# Altium project DOOR_PCB_MAIN.PrjPcb
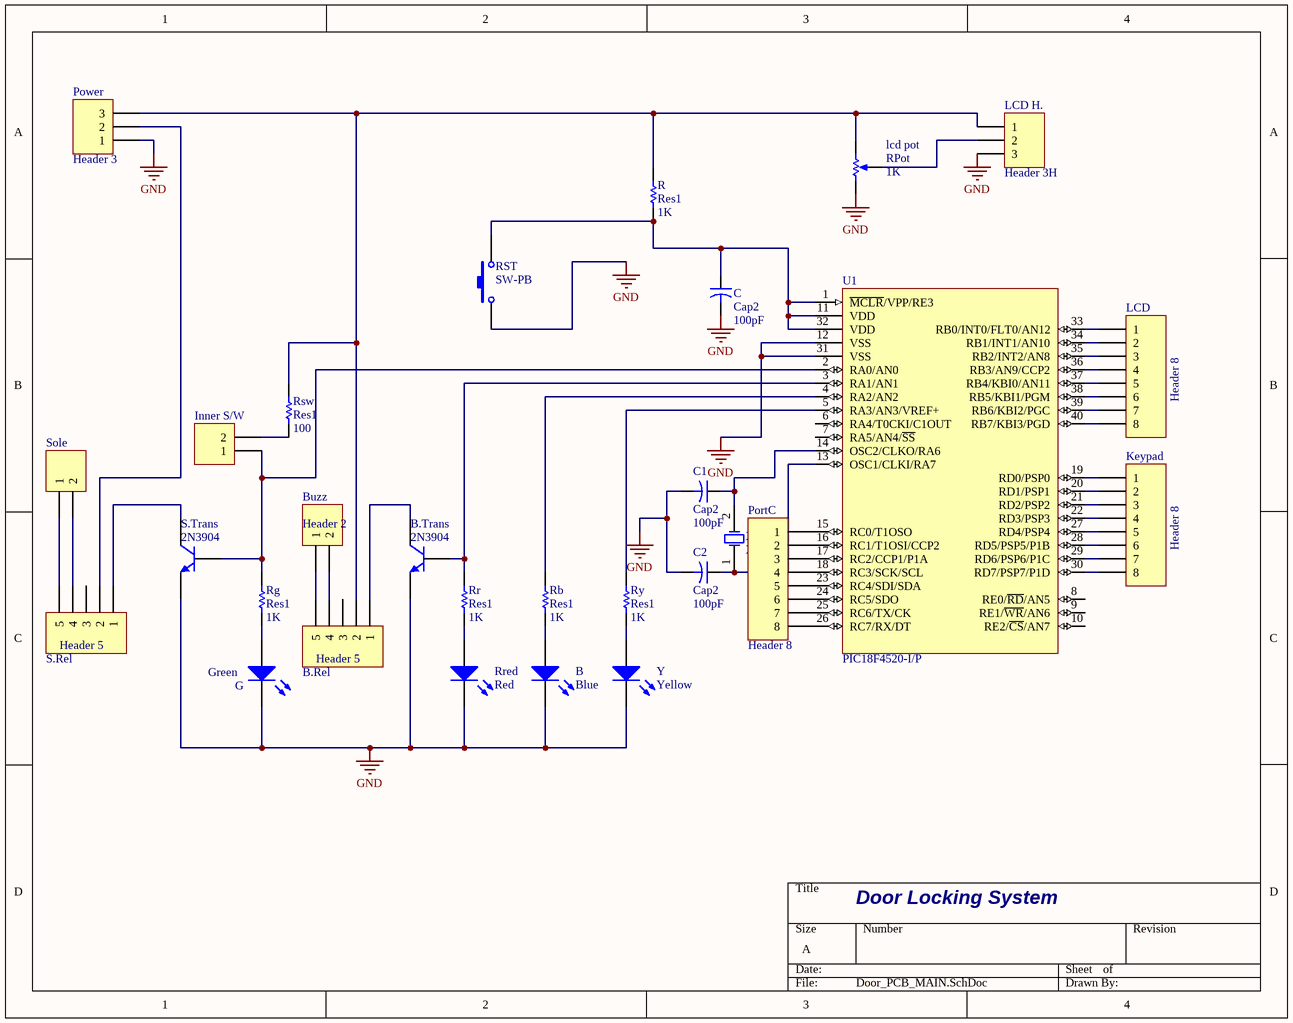
[diagram p0: Door_PCB_MAIN.SchDoc]
1 sheet, 29 parts. Net scope: global (net labels, ports and power ports of the same name join across sheets).
Board file: DOOR_PCB_MAIN.PcbDoc

## Sheet Door_PCB_MAIN.SchDoc
size A

### Parts
B  Blue  [LED-0]
B.Rel  Header 5  [relay]
B.Trans  2N3904  [HDR1X3]
Buzz  Header 2  [HDR1X2]
C  Cap2  value 100pF  [CAPR5-4X5]
C1  Cap2  value 100pF  [CAPR5-4X5]
C2  Cap2  value 100pF  [CAPR5-4X5]
G  Green  [LED-0]
Inner_S/W  Header 2  [HDR1X2]  (value not drawn)
Keypad  Header 8  [HDR1X8]
LCD  Header 8  [HDR1X8]
LCD_H.  Header 3H  [HDR1X3H]
lcd_pot  RPot  value 1K  [VR5]
PortC  Header 8  [HDR1X8]
Power  Header 3  [HDR1X3]
R  Res1  value 1K  [AXIAL-0.3]
Rb  Res1  value 1K  [AXIAL-0.3]
Rg  Res1  value 1K  [AXIAL-0.3]
Rr  Res1  value 1K  [AXIAL-0.3]
Rred  Red  [LED-0]
RST  SW-PB  [SPST-2]
Rsw  Res1  value 100  [AXIAL-0.3]
Ry  Res1  value 1K  [AXIAL-0.3]
S.Rel  Header 5  [relay]
S.Trans  2N3904  [HDR1X3]
Sole  Header 2  [HDR1X2]  (value not drawn)
U1  PIC18F4520-I/P  [PDIP600-P40]
X  XTAL  [R38]
Y  Yellow  [LED-0]

### Nets
GND: B.2(K) B.Trans.1(E) C.2 C1.2 C2.2 G.2(K) LCD_H..3 lcd_pot.1(TOP) Power.1 Rred.2(K) RST.1 S.Trans.1(E) U1.12(VSS) U1.31(VSS) Y.2(K)
NetB.Rel_1: B.Rel.1 B.Trans.3(C)
NetB.Rel_2: B.Rel.2 LCD_H..1 lcd_pot.2(BOT) Power.3 R.2 Rsw.2
NetB.Rel_4: B.Rel.4 Buzz.2
NetB.Rel_5: B.Rel.5 Buzz.1
NetB.Trans_2: B.Trans.2(B) Rr.2 U1.3(RA1/AN1)
NetB_1: B.1(A) Rb.1
NetC1_1: C1.1 U1.14(OSC2/CLKO/RA6) X.2(OSC2)
NetC2_1: C2.1 U1.13(OSC1/CLKI/RA7) X.1(OSC1)
NetC_1: C.1 R.1 RST.2 U1.1(~{MCLR}/VPP/RE3) U1.11(VDD) U1.32(VDD)
NetG_1: G.1(A) Rg.1
NetInner_S/W_1: Inner_S/W.1 Rg.2 S.Trans.2(B) U1.2(RA0/AN0)
NetInner_S/W_2: Inner_S/W.2 Rsw.1
NetKeypad_1: Keypad.1 U1.19(RD0/PSP0)
NetKeypad_2: Keypad.2 U1.20(RD1/PSP1)
NetKeypad_3: Keypad.3 U1.21(RD2/PSP2)
NetKeypad_4: Keypad.4 U1.22(RD3/PSP3)
NetKeypad_5: Keypad.5 U1.27(RD4/PSP4)
NetKeypad_6: Keypad.6 U1.28(RD5/PSP5/P1B)
NetKeypad_7: Keypad.7 U1.29(RD6/PSP6/P1C)
NetKeypad_8: Keypad.8 U1.30(RD7/PSP7/P1D)
NetLCD_1: LCD.1 U1.33(RB0/INT0/FLT0/AN12)
NetLCD_2: LCD.2 U1.34(RB1/INT1/AN10)
NetLCD_3: LCD.3 U1.35(RB2/INT2/AN8)
NetLCD_4: LCD.4 U1.36(RB3/AN9/CCP2)
NetLCD_5: LCD.5 U1.37(RB4/KBI0/AN11)
NetLCD_6: LCD.6 U1.38(RB5/KBI1/PGM)
NetLCD_7: LCD.7 U1.39(RB6/KBI2/PGC)
NetLCD_8: LCD.8 U1.40(RB7/KBI3/PGD)
NetLCD_H._2: LCD_H..2 lcd_pot.3(TAP)
NetPortC_1: PortC.1 U1.15(RC0/T1OSO)
NetPortC_2: PortC.2 U1.16(RC1/T1OSI/CCP2)
NetPortC_3: PortC.3 U1.17(RC2/CCP1/P1A)
NetPortC_4: PortC.4 U1.18(RC3/SCK/SCL)
NetPortC_5: PortC.5 U1.23(RC4/SDI/SDA)
NetPortC_6: PortC.6 U1.24(RC5/SDO)
NetPortC_7: PortC.7 U1.25(RC6/TX/CK)
NetPortC_8: PortC.8 U1.26(RC7/RX/DT)
NetPower_2: Power.2 S.Rel.2
NetRb_2: Rb.2 U1.4(RA2/AN2)
NetRr_1: Rr.1 Rred.1(A)
NetRy_1: Ry.1 Y.1(A)
NetRy_2: Ry.2 U1.5(RA3/AN3/VREF+)
NetS.Rel_1: S.Rel.1 S.Trans.3(C)
NetS.Rel_4: S.Rel.4 Sole.2
NetS.Rel_5: S.Rel.5 Sole.1

Not connected (* = marked no-connect by the designer): B.Rel 3; S.Rel 3; U1 6(RA4/T0CKI/C1OUT) 7(RA5/AN4/~{SS}) 8(RE0/~{RD}/AN5) 9(RE1/~{WR}/AN6) 10(RE2/~{CS}/AN7)

### Notes on the sheet
- Door Locking System

### Library data of the parts
B = LED3: Typical BLUE SiC LED; Published: 8-Jun-2000; LatestRevisionDate: 17-Dec-2003; LatestRevisionNote: PCB Footprint replaced.; DatasheetVersion: 16-Apr-2002; PackageVersion: 16-Apr-2002; PackageReference: 3.5X2.8X1.9; Publisher: Altium Limited; PackageDescription: SM LED; 2 C-Bend Leads; Body 3.5 x 2.8 x 1.9 mm, inc leads (LxWxH typ)
B.Rel S.Rel = Header 5: Header, 5-Pin; LatestRevisionDate: 17-Jul-2002; LatestRevisionNote: Re-released for DXP Platform.; Publisher: Altium Limited
B.Trans S.Trans = 2N3904: NPN General Purpose Amplifier; Published: 8-Jun-2000; LatestRevisionDate: 15-Jan-2003; LatestRevisionNote: PCB Footprint 'BCY-W3/D4.7' replaced; DatasheetVersion: 1997; PackageVersion: Sep-1998; PackageReference: TO-92A; Publisher: Altium Limited; PackageDescription: TO, Flat Index; 3 In-Line, Axial Leads; Body Dia. 4.5mm; Leads 0.51 x 0.48 mm (max); ComponentLink1Description: Manufacturer Link; ComponentLink1URL: http://www.fairchildsemi.com/; ComponentLink2Description: Datasheet; ComponentLink2URL: http://www.fairchildsemi.com/ds/2N%2F2N3904.pdf
Buzz Inner_S/W Sole = Header 2: Header, 2-Pin; LatestRevisionDate: 17-Jul-2002; LatestRevisionNote: Re-released for DXP Platform.; Publisher: Altium Limited
C C1 C2 = Cap2: Capacitor; Published: 23-Sep-2002; PackageReference: CAPR5-4X5; Publisher: Altium Limited; PackageDescription: Capacitor; 2 Leads
G Rred Y = LED2: Typical RED, GREEN, YELLOW, AMBER GaAs LED; Published: 8-Jun-2000; LatestRevisionDate: 17-Jul-2002; LatestRevisionNote: Re-released for DXP Platform.; PackageVersion: Feb-2002; PackageReference: 3.2X1.6X1.1; Publisher: Altium Limited; PackageDescription: SM LED; 2 Flat Leads
Keypad LCD PortC = Header 8: Header, 8-Pin; LatestRevisionDate: 17-Jul-2002; LatestRevisionNote: Re-released for DXP Platform.; Publisher: Altium Limited
LCD_H. = Header 3H: Header, 3-Pin, Right Angle; LatestRevisionDate: 17-Jul-2002; LatestRevisionNote: Re-released for DXP Platform.; Publisher: Altium Limited
lcd_pot = RPot: Potentiometer; Sim Note: Enter the Resistance value and the set point into parameter fields.; Set Position: 0.5; Published: 8-Jun-2000; LatestRevisionDate: 17-Jul-2002; LatestRevisionNote: Re-released for DXP Platform.; PackageReference: VR5; Publisher: Altium Limited; PackageDescription: Variable Resistor, Thru-Hole; 3 Leads
Power = Header 3: Header, 3-Pin; LatestRevisionDate: 17-Jul-2002; LatestRevisionNote: Re-released for DXP Platform.; Publisher: Altium Limited
R Rb Rg Rr Rsw Ry = Res1: Resistor; Published: 8-Jun-2000; LatestRevisionDate: 17-Jul-2002; LatestRevisionNote: Re-released for DXP Platform.; PackageReference: AXIAL-0.3; Publisher: Altium Limited; PackageDescription: Axial Device, Thru-Hole; 2 Leads; 0.3 in Pin Spacing
RST = SW-PB: Switch; Published: 24-Mar-1999; LatestRevisionDate: 17-Jul-2002; LatestRevisionNote: Re-released for DXP Platform.; PackageReference: SPST-2; Publisher: Altium Limited; PackageDescription: Switch; 2 Leads
U1 = PIC18F4520-I/P: Enhanced Flash Microcontroller with 10-Bit A/D and nanoWatt Technology, 32K Flash, 40-Pin PDIP, Industrial Temperature Range; Published: 29-Jan-2009; LatestRevisionDate: 02-Dec-2009; LatestRevisionNote: Updated to datasheet revision E, Oct-2008; DatasheetVersion: revE, Oct-2008; PackageVersion: revBB, Aug-2009; PackageReference: PDIP600-P40; Publisher: Altium Limited; PackageDescription: 40-Lead Plastic Dual In-Line (P) - 600 mil Body [PDIP]; Supplier 1: Digi-Key; Supplier Part Number 1: PIC18F4520-I/P-ND; Supplier 2: Farnell; Supplier Part Number 2: 1523812; Supplier 3: Farnell; Supplier Part Number 3: 1212702; ComponentLink1Description: Datasheet; ComponentLink1URL: http://ww1.microchip.com/downloads/en/DeviceDoc/39631E.pdf; ComponentLink2Description: Packaging Specification; ComponentLink2URL: http://www.microchip.com/stellent/groups/techpub_sg/documents/packagingspec/en012702.pdf; ComponentLink3Description: Microchip.com Home; ComponentLink3URL: http://www.microchip.com/
X = XTAL: Crystal Oscillator; Published: 8-Jun-2000; LatestRevisionDate: 17-Jul-2002; LatestRevisionNote: Re-released for DXP Platform.; PackageReference: R38; Publisher: Altium Limited; PackageDescription: Crystal, Thru-Hole; 2 Leads; Body 3.1 x 8.2 mm (Dia.xH)